# EAGLE schematic Overall_Sys_Schematic (EAGLE 9.2.2)
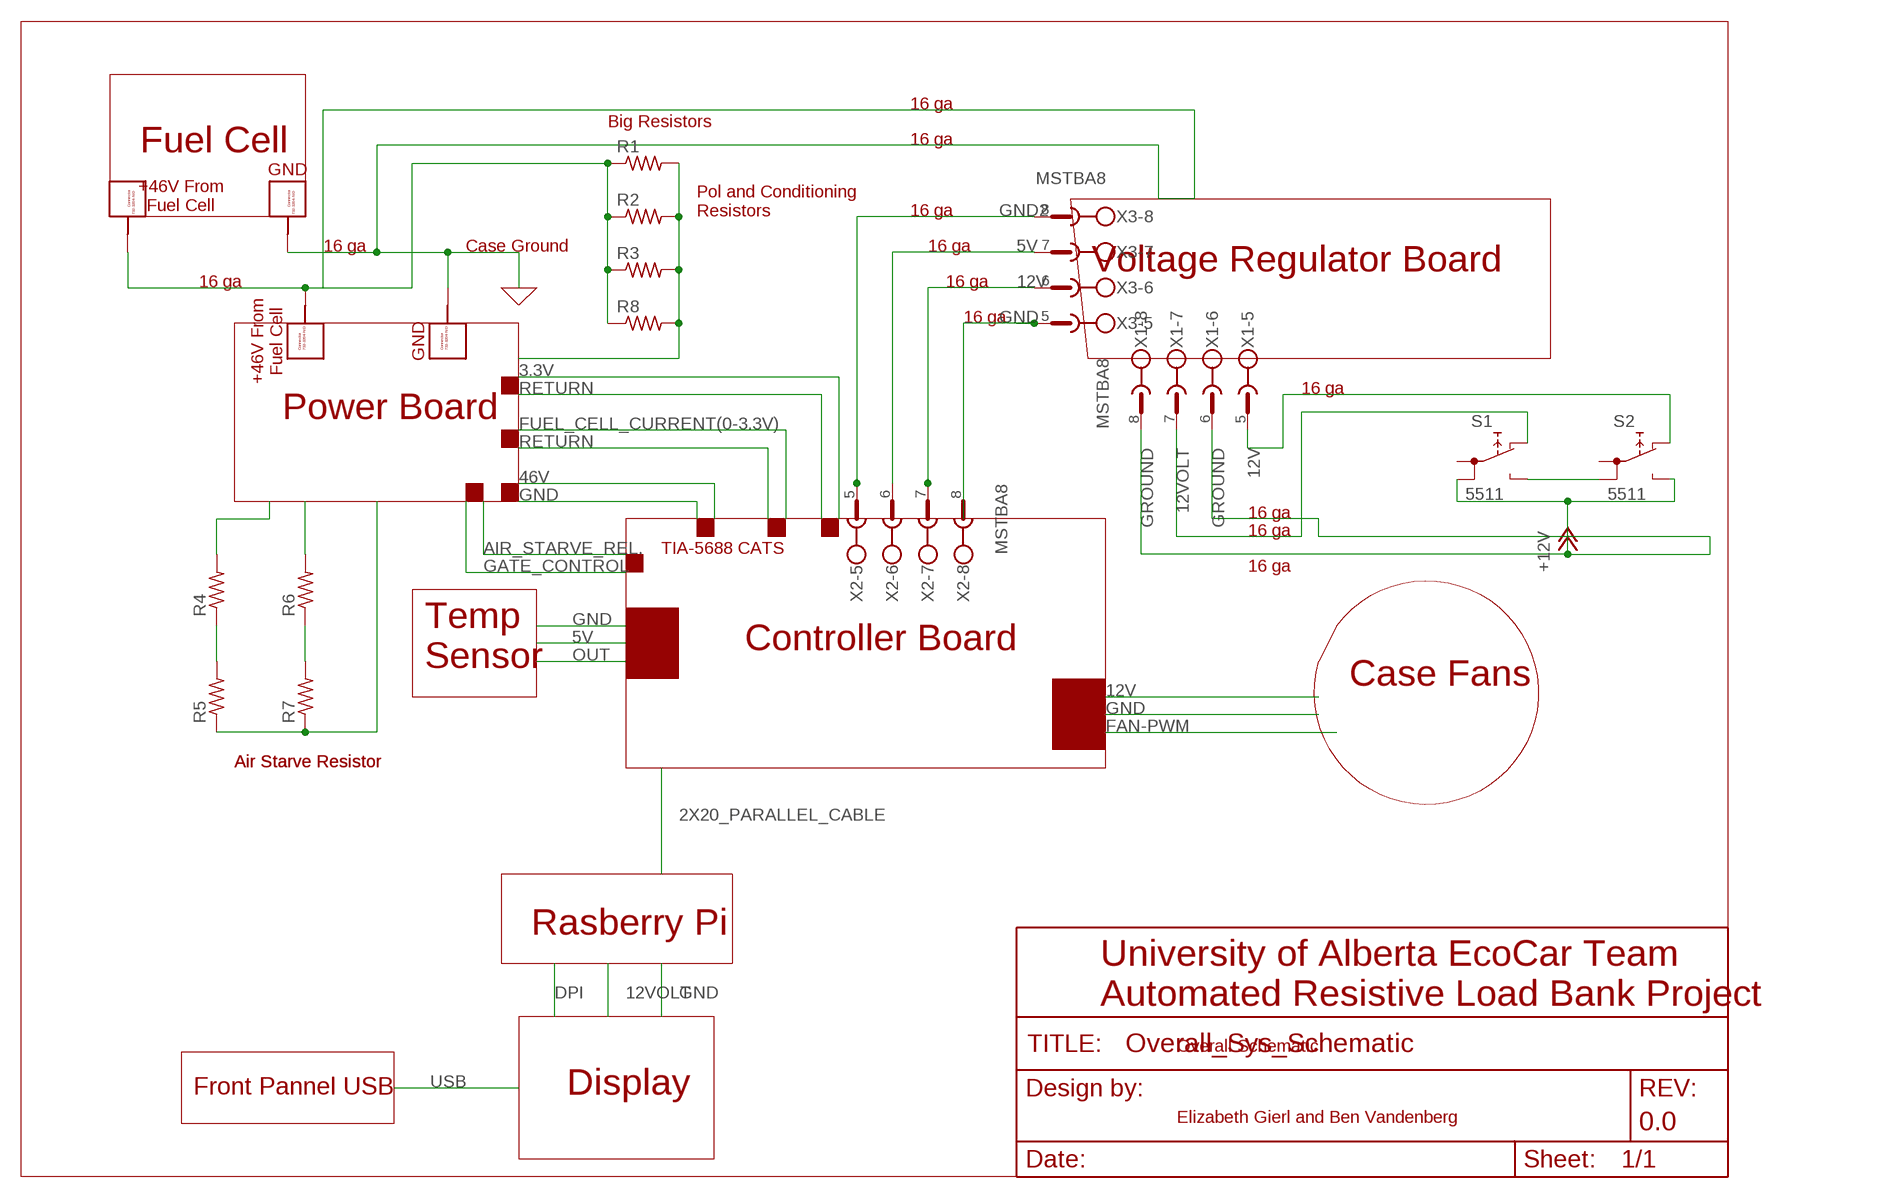
[diagram p0: schematic, sheet 1]

## Parts
FC.POS  732-3204-ND_CONNECTOR  [732-3204-ND]
FC.POS1  732-3204-ND_CONNECTOR  [732-3204-ND]
FC.POS2  732-3204-ND_CONNECTOR  [732-3204-ND]
FC.POS3  732-3204-ND_CONNECTOR  [732-3204-ND]
FRAME1  FRAME-LETTERNO_PACKAGE  [DUMMY]
R1  R-US_0204/2V  [0204V]
R2  R-US_0204/2V  [0204V]
R3  R-US_0204/2V  [0204V]
R4  R-US_0204/2V  [0204V]
R5  R-US_0204/2V  [0204V]
R6  R-US_0204/2V  [0204V]
R7  R-US_0204/2V  [0204V]
R8  R-US_0204/2V  [0204V]
S1  5511  [5511]
S2  5511  [5511]
X1  MSTBA8  [MSTBA8]
X2  MSTBA8  [MSTBA8]
X3  MSTBA8  [MSTBA8]

## Nets
0: FC.POS1.P$1 FC.POS1.P$2 FC.POS1.P$3 FC.POS1.P$4 FC.POS1.P$5 FC.POS1.P$6 FC.POS1.P$7 FC.POS1.P$8 FC.POS1.P$9 FC.POS1.P$10 FC.POS2.P$1 FC.POS2.P$2 FC.POS2.P$3 FC.POS2.P$4 FC.POS2.P$5 FC.POS2.P$6 FC.POS2.P$7 FC.POS2.P$8 FC.POS2.P$9 FC.POS2.P$10 FC.POS3.P$1 FC.POS3.P$2 FC.POS3.P$3 FC.POS3.P$4 FC.POS3.P$5 FC.POS3.P$6 FC.POS3.P$7 FC.POS3.P$8 FC.POS3.P$9 FC.POS3.P$10 FC.POS.P$1 FC.POS.P$2 FC.POS.P$3 FC.POS.P$4 FC.POS.P$5 FC.POS.P$6 FC.POS.P$7 FC.POS.P$8 FC.POS.P$9 FC.POS.P$10 R1.1 R2.1 R3.1 R8.1 ; supply symbol labelled GND
5V: X2.6 X3.7
12V: S2.NC X1.5 X2.7 X3.6
12VOLT: S1.NC X1.7
GND: X3.5
GND1: X2.8
GND2: X2.5 X3.8
GROUND: S1.1B S2.NO X1.6 X1.8 ; supply symbol labelled +12V
N$1: R5.1 R7.1
N$2: R4.1 R5.2
N$3: S1.NO S2.1B
N$4: R6.1 R7.2
N$5: R6.2
N$6: R4.2
N$9: R1.2 R2.2 R3.2 R8.2
Unconnected: S1.1A S2.1A X1.1 X1.2 X1.3 X1.4 X2.1 X2.2 X2.3 X2.4 X3.1 X3.2 X3.3 X3.4

## Notes on the sheet
- 16 ga
- Big Resistors
- 16 ga
- Fuel Cell
- GND
- +46V From
  Fuel Cell
- Pol and Conditioning
  Resistors
- 16 ga
- Voltage Regulator Board
- 16 ga | Case Ground | 16 ga
- 16 ga | 16 ga
- 16 ga
- +46V From
  Fuel Cell
- GND
- 16 ga
- Power Board
- 16 ga
- 16 ga
- TIA-5688 CATS
- 16 ga
- Controller Board
- Temp
  Sensor
- Case Fans
- Air Starve Resistor | Air Starve Resistor
- Rasberry Pi
- University of Alberta EcoCar Team
  Automated Resistive Load Bank Project
- Overall Schematic
- Front Pannel USB | Display
- Elizabeth Gierl and Ben Vandenberg

## Library data of the parts
FC.POS FC.POS1-FC.POS3 = Connector 732-3204:732-3204-ND_CONNECTOR
FRAME1 = SparkFun-Aesthetics:FRAME-LETTER: Schematic Frame - Letter Standard 8.5x11 US Letter frame; DESIGNER: Ben Vandenberg; REV: 0.0; VERSION: v01
R1-R8 = rcl:R-US_: RESISTOR, American symbol; SPICEPREFIX: R
S1 S2 = switch:55?: PUSHBUTTON SERIES 5500 SWITCHES Source: www.e-switch.com .. 5500.pdf
X1-X3 = con-phoenix-508:MSTBA8: PHOENIX; MF: FARNELL; MPN: 1757307; OC_FARNELL: 3705225; OC_NEWARK: 71C4166